# EAGLE schematic md80sv_adapter (EAGLE 8.1.0)
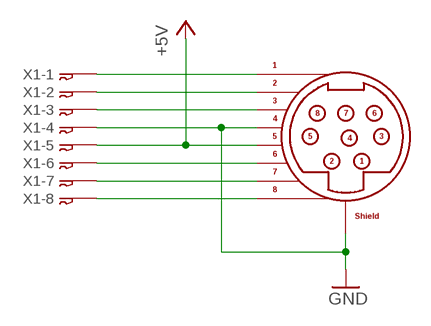
[diagram p0: schematic, sheet 1]

## Parts
U$1  MD-80SV  [MD-80SV]
X1  08-JST-B8B-XH-A  [B8B-XH]

## Nets
+5V: U$1.P$5 X1.P$5
GND: U$1.GND@1 U$1.GND@2 U$1.P$4 X1.P$4
N$1: U$1.P$1 X1.P$1
N$2: U$1.P$2 X1.P$2
N$3: U$1.P$3 X1.P$3
N$6: U$1.P$6 X1.P$6
N$7: U$1.P$7 X1.P$7
N$8: U$1.P$8 X1.P$8

## Library data of the parts
U$1 = arcadetv:MD-80SV
X1 = con-jst-xh:08-JST: JST CONNECTOR